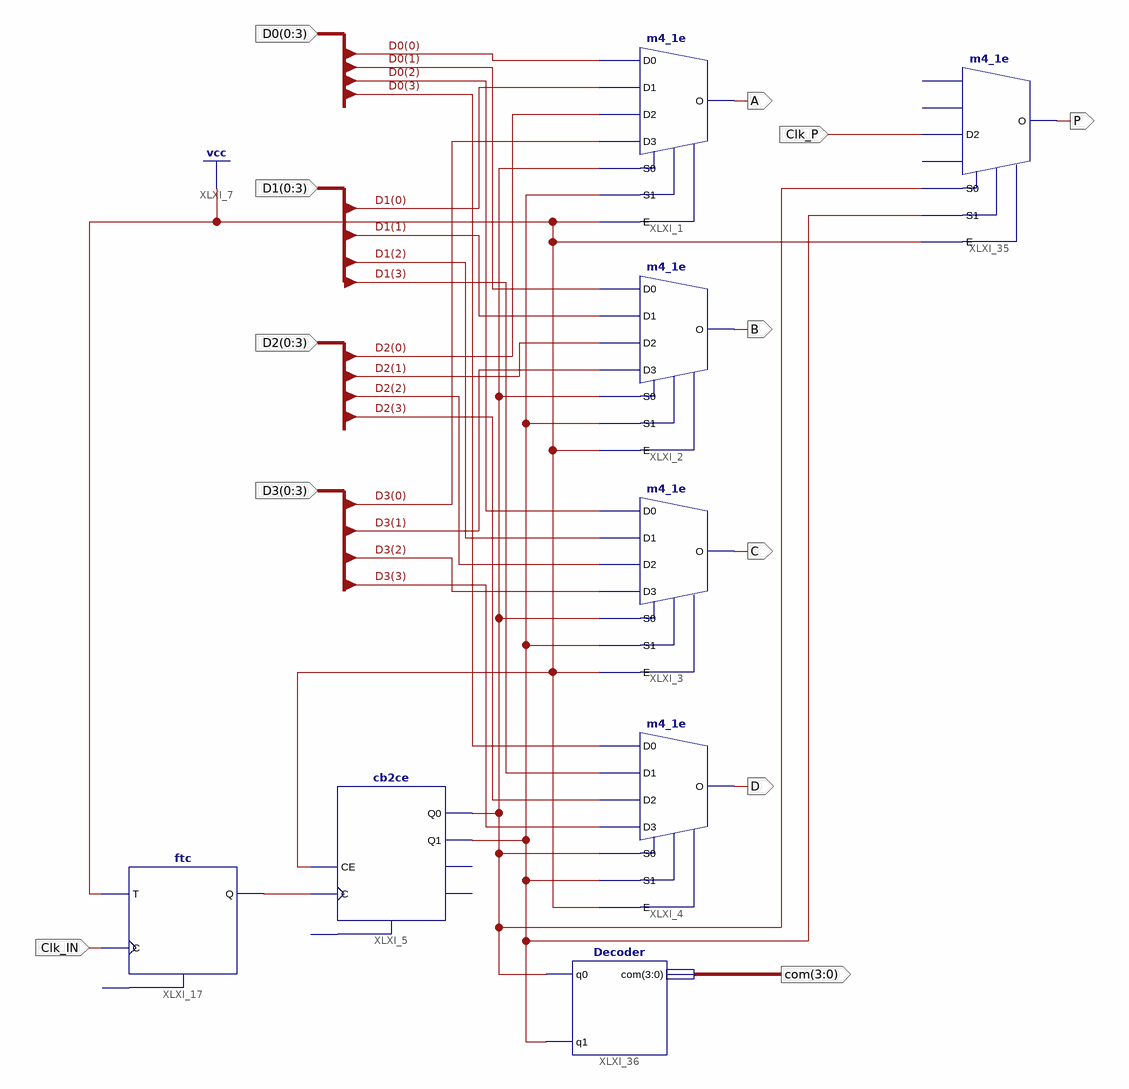
[diagram p0: schematic sheet 1]
// Xilinx ISE schematic MUXX.sch (spartan6) as structural Verilog: 8 symbols, 12 ports
module MUXX (
  input  [0:3] D0,
  input  [0:3] D1,
  input  [0:3] D2,
  input  [0:3] D3,
  input  Clk_IN,
  input  Clk_P,
  output A,
  output B,
  output C,
  output D,
  output P,
  output [3:0] com
);

  wire XLXN_53, XLXN_127, XLXN_128;

  m4_1e XLXI_1 (.D0(D0[0]), .D1(D1[0]), .D2(D2[0]), .D3(D3[0]), .E(1'b1), .S0(XLXN_127), .S1(XLXN_128), .O(A));
  m4_1e XLXI_2 (.D0(D0[1]), .D1(D1[1]), .D2(D2[1]), .D3(D3[1]), .E(1'b1), .S0(XLXN_127), .S1(XLXN_128), .O(B));
  m4_1e XLXI_3 (.D0(D0[2]), .D1(D1[2]), .D2(D2[2]), .D3(D3[2]), .E(1'b1), .S0(XLXN_127), .S1(XLXN_128), .O(C));
  m4_1e XLXI_4 (.D0(D0[3]), .D1(D1[3]), .D2(D2[3]), .D3(D3[3]), .E(1'b1), .S0(XLXN_127), .S1(XLXN_128), .O(D));
  cb2ce XLXI_5 (.C(XLXN_53), .CE(1'b1), .Q0(XLXN_127), .Q1(XLXN_128));  // open: CLR, CEO, TC
  ftc XLXI_17 (.C(Clk_IN), .T(1'b1), .Q(XLXN_53));  // open: CLR
  Decoder XLXI_36 (.com(com), .q0(XLXN_127), .q1(XLXN_128));
  m4_1e XLXI_35 (.D2(Clk_P), .E(1'b1), .S0(XLXN_127), .S1(XLXN_128), .O(P));  // open: D0, D1, D3
endmodule
